# Altium project PowerBar.PrjPCB
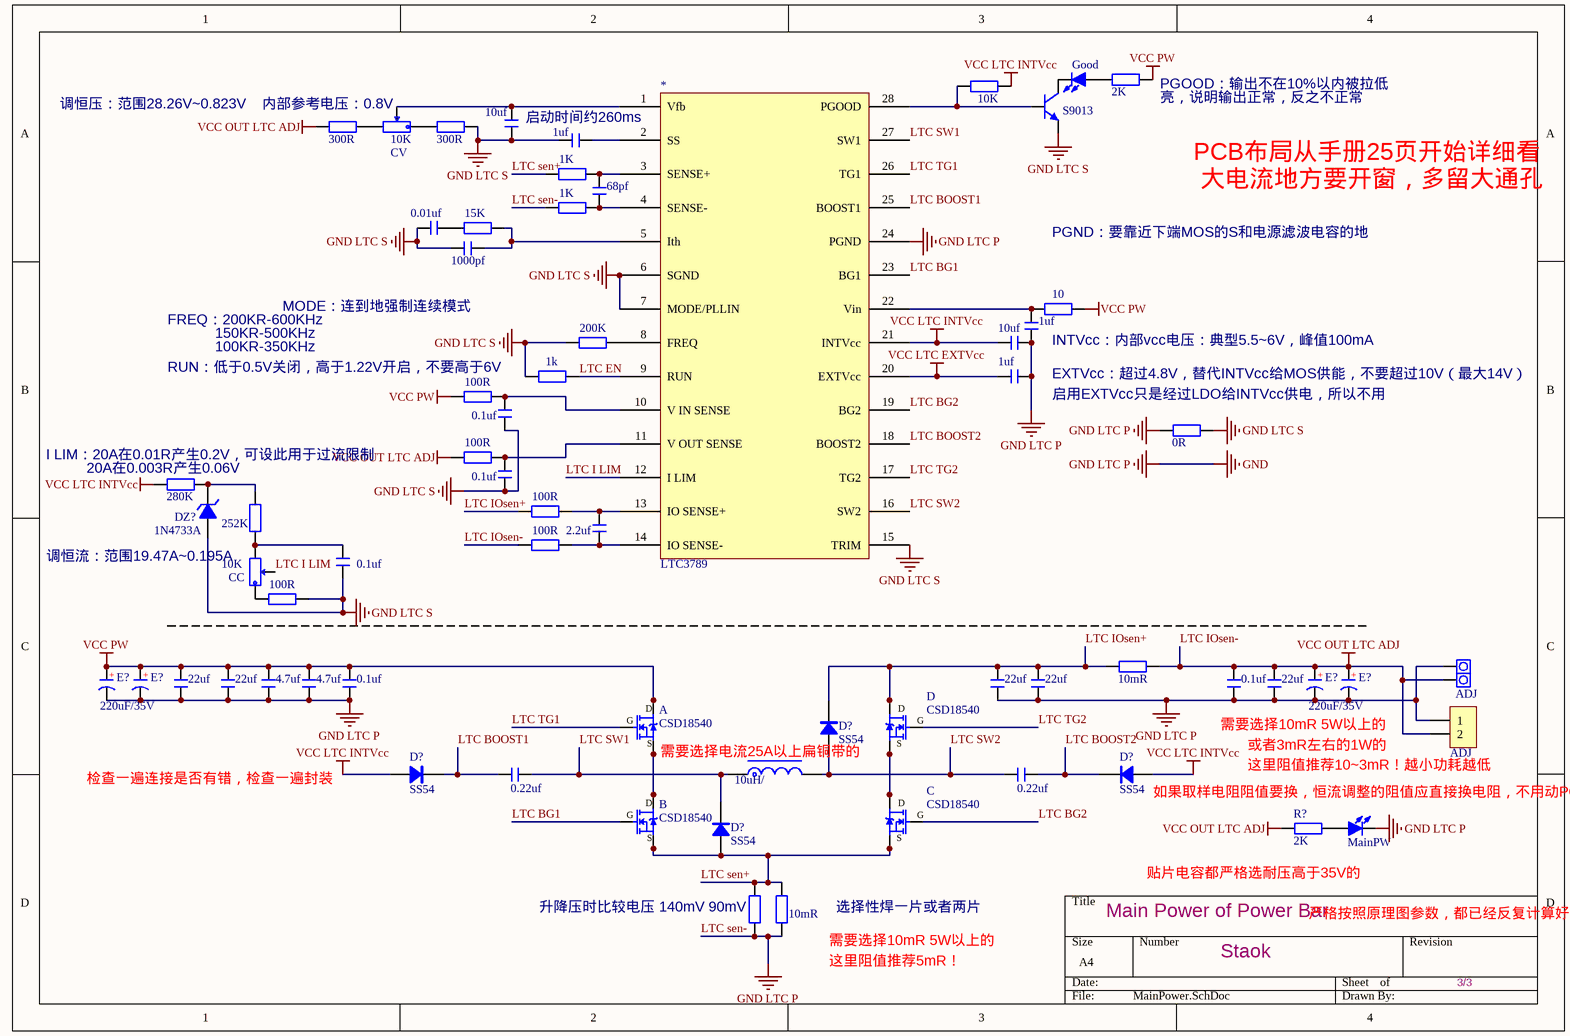
[diagram p0: MainPower.SchDoc]
3 sheets, 317 parts. Net scope: global (net labels, ports and power ports of the same name join across sheets).
Board file: PowerBar.PcbDoc
Sheets:
  MainPower.SchDoc
  SubPowerr.SchDoc
  modules.SchDoc

## Sheet MainPower.SchDoc: Main Power of Power Bar
size A4; Author: Staok

### Parts
(Parts that share a designator on the sheet are numbered #1, #2 ... from top to bottom, then left to right.)
*  LTC3789  [SSOP28_N]
A  CSD18540  [Q5B]
B  CSD18540  [Q5B]
C  CSD18540  [Q5B]
C?#1  10uf  [C 0805_L]
C?#2  1uf  [C 0805_L]
C?#3  68pf  [C 0805_L]
C?#4  0.01uf  [C 0805_L]
C?#5  1000pf  [C 0805_L]
C?#6  1uf  [C 0805_L]
C?#7  10uf  [C 0805_L]
C?#8  1uf  [C 0805_L]
C?#9  0.1uf  [C 0805_L]
C?#10  0.1uf  [C 0805_L]
C?#11  2.2uf  [C 0805_L]
C?#12  0.1uf  [C 0805_L]
C?#13  22uf  [C 0805_L]
C?#14  22uf  [C 0805_L]
C?#15  22uf  [C 0805_L]
C?#16  4.7uf  [C 0805_L]
C?#17  4.7uf  [C 0805_L]
C?#18  0.1uf  [C 0805_L]
C?#19  22uf  [C 0805_L]
C?#20  0.1uf  [C 0805_L]
C?#21  22uf  [C 0805_L]
C?#22  0.22uf  [C 0805_L]
C?#23  0.22uf  [C 0805_L]
CC  10K  [RV097-1-G15]
CV  10K  [RV097-1-G15]
D  CSD18540  [Q5B]
D?#1  SS54  [SMA]
D?#2  SS54  [SMA]
D?#3  SS54  [SMA]
D?#4  SS54  [SMA]
DZ?#1  1N4733A  [DO-41GV]
E?#1  220uF/35V  [CS 3.5*8*11.5 - R]
E?#2  220uF/35V  [CS 3.5*8*11.5 - R]  (value not drawn)
E?#3  220uF/35V  [CS 3.5*8*11.5 - R]
E?#4  220uF/35V  [CS 3.5*8*11.5 - R]  (value not drawn)
H?#1  ADJ  [T Head]
JP?#1  ADJ  [KF128-5.08-2P]
L?#1  10uH/  [L-SMD-0630]
LED?#1  Good  [LED 0805B]
LED?#2  MainPW  [LED 0805B]
Q?#1  S9013  [SOT23-3L]
R?#1  2K  [R 0805_L]
R?#2  10K  [R 0805_L]
R?#3  300R  [R 0805_L]
R?#4  300R  [R 0805_L]
R?#5  1K  [R 0805_L]
R?#6  1K  [R 0805_L]
R?#7  15K  [R 0805_L]
R?#8  10  [R 0805_L]
R?#9  200K  [R 0805_L]
R?#10  1k  [R 0805_L]
R?#11  100R  [R 0805_L]
R?#12  0R  [R 0805_L]
R?#13  100R  [R 0805_L]
R?#14  280K  [R 0805_L]
R?#15  252K  [R 0805_L]
R?#16  100R  [R 0805_L]
R?#17  100R  [R 0805_L]
R?#18  100R  [R 0805_L]
R?#19  10mR  [R 2512-HP_M]
R?#20  2K  [R 0805_L]
R?#21  10mR  [R 2512-HP_M]  (value not drawn)
R?#22  10mR  [R 2512-HP_M]

### Nets
GND LTC S: *.6(SGND) *.7(MODE/PLLIN) *.15(TRIM) C?#1.1 C?#2.2 C?#4.2 C?#5.2 C?#9.2 C?#10.2 C?#12.2 DZ?#1.1(A) Q?#1.2(E) R?#4.1 R?#9.1 R?#10.2 R?#12.2 R?#18.1
LTC IOsen-: C?#20.2 C?#21.2 E?#3.1(A) E?#4.1(A) H?#1.2 JP?#1.2 R?#3.1 R?#13.1 R?#17.1 R?#19.1 R?#20.2  [also labelled VCC OUT LTC ADJ]
LTC sen-: *.24(PGND) C?#6.2 C?#7.2 C?#8.2 C?#13.2 C?#14.2 C?#15.1 C?#16.1 C?#17.1 C?#18.1 C?#19.1 C?#20.1 C?#21.1 E?#1.2(K) E?#2.2(K) E?#3.2(K) E?#4.2(K) H?#1.1 JP?#1.1 LED?#2.2(K) R?#6.1 R?#12.1 R?#21.1 R?#22.1  [also labelled GND, GND LTC P]
VCC LTC EXTVcc: *.20(EXTVcc) C?#8.1
VCC LTC INTVcc: *.21(INTVcc) C?#7.1 D?#2.1(A) D?#3.1(A) R?#2.2 R?#14.2
VCC PW: A.5(D) A.6(D) A.7(D) A.8(D) C?#13.1 C?#15.2 C?#16.2 C?#17.2 C?#18.2 E?#1.1(A) E?#2.1(A) R?#1.1 R?#8.2 R?#11.1
LTC BG1: *.23(BG1) B.4(G)
LTC BG2: *.19(BG2) C.4(G)
LTC BOOST1: *.25(BOOST1) C?#22.2 D?#2.2(K)
LTC BOOST2: *.18(BOOST2) C?#23.1 D?#3.2(K)
LTC EN: *.9(RUN) R?#10.1
LTC I LIM: *.12(I_LIM) CC.2
LTC IOsen+: C?#14.1 C?#19.2 D.5(D) D.6(D) D.7(D) D.8(D) D?#1.2(K) R?#16.1 R?#19.2
LTC sen+: B.1(S) B.2(S) B.3(S) C.1(S) C.2(S) C.3(S) D?#4.1(A) R?#5.1 R?#21.2 R?#22.2
LTC SW1: *.27(SW1) C?#22.1 D?#4.2(K) L?#1.1
LTC SW2: *.16(SW2) C?#23.2 D?#1.1(A) L?#1.2
LTC TG1: *.26(TG1) A.4(G)
LTC TG2: *.17(TG2) D.4(G)
Net*_1: *.1(Vfb) C?#1.2 CV.2
Net*_2: *.2(SS) C?#2.1
Net*_3: *.3(SENSE+) C?#3.1 R?#5.2
Net*_4: *.4(SENSE-) C?#3.2 R?#6.2
Net*_5: *.5(Ith) C?#5.1 R?#7.2
Net*_8: *.8(FREQ) R?#9.2
Net*_10: *.10(V_IN_SENSE) C?#9.1 R?#11.2
Net*_11: *.11(V_OUT_SENSE) C?#10.1 R?#13.2
Net*_13: *.13(IO_SENSE+) C?#11.1 R?#16.2
Net*_14: *.14(IO_SENSE-) C?#11.2 R?#17.2
Net*_22: *.22(Vin) C?#6.1 R?#8.1
Net*_28: *.28(PGOOD) Q?#1.1(B) R?#2.1
NetA_1: A.1(S) A.2(S) A.3(S) B.5(D) B.6(D) B.7(D) B.8(D)
NetC?#4_1: C?#4.1 R?#7.1
NetC?#12_1: C?#12.1 CC.3 R?#15.2
NetC_5: C.5(D) C.6(D) C.7(D) C.8(D) D.1(S) D.2(S) D.3(S)
NetCC_1: CC.1 R?#18.2
NetCV_1: CV.1 R?#4.2
NetCV_3: CV.3 R?#3.2
NetDZ?#1_2: DZ?#1.2(K) R?#14.1 R?#15.1
NetLED?#1_1: LED?#1.1(A) R?#1.2
NetLED?#1_2: LED?#1.2(K) Q?#1.3(C)
NetLED?#2_1: LED?#2.1(A) R?#20.1

### Notes on the sheet
- 调恒压：范围28.26V~0.823V
- (near R?#3) 内部参考电压：0.8V
- (near R?#1) PGOOD：输出不在10%以内被拉低
- (near R?#1) 亮，说明输出正常，反之不正常
- (near C?#1) 启动时间约260ms
- PCB布局从手册25页开始详细看
- PGND：要靠近下端MOS的S和电源滤波电容的地
- 大电流地方要开窗，多留大通孔
- MODE：连到地强制连续模式
- RUN：低于0.5V关闭，高于1.22V开启，不要高于6V
- FREQ：200KR-600KHz
- 150KR-500KHz
- 100KR-350KHz
- INTVcc：内部vcc电压：典型5.5~6V，峰值100mA
- (near C?#8) EXTVcc：超过4.8V，替代INTVcc给MOS供能，不要超过10V（最大14V）
- 启用EXTVcc只是经过LDO给INTVcc供电，所以不用
- (near R?#14) I LIM：20A在0.01R产生0.2V，可设此用于过流限制
- (near R?#14) 20A在0.003R产生0.06V
- (near DZ?#1) 调恒流：范围19.47A~0.195A
- 检查一遍连接是否有错，检查一遍封装
- 需要选择电流25A以上扁铜带的
- (near C?#21) 需要选择10mR 5W以上的
- 或者3mR左右的1W的
- 这里阻值推荐10~3mR！越小功耗越低
- 如果取样电阻阻值要换，恒流调整的阻值应直接换电阻，不用动PCB
- 升降压时比较电压 140mV 90mV
- 选择性焊一片或者两片
- (near R?#20) 贴片电容都严格选耐压高于35V的
- 严格按照原理图参数，都已经反复计算好
- (near R?#22) 需要选择10mR 5W以上的
- 这里阻值推荐5mR！
- 3/3
- (in symbol C-CS) +

### Library data of the parts
C?#1-C?#23 = C: 无极性贴片电容; 版权归属: 源创客; 材质: X7R; BOM名称: 无极性贴片电容; 学习资源: www.ooocke.com
CC CV = RP-ID: 插件单联电位器; BOM名称: 插件电位器; 版权归属: 源创客; 学习资源: www.ooocke.com
D?#1-D?#4 = SS54: 肖特基二极管; 版权归属: 源创客; 属性: 40V/3A; BOM名称: 肖特基二极管; 学习资源: www.ooocke.com
DZ?#1 = 1N4620: 3.3V/0.5W稳压管; 版权归属: 源创客; BOM名称: 3.3V/0.5W稳压管; 学习资源: www.ooocke.com
E?#1-E?#4 = C-CS: 直插固态电容; 版权归属: 源创客; BOM名称: 直插固态电容; 学习资源: www.ooocke.com
H?#1 = PAD2: 引线焊盘; 版权归属: 源创客; BOM名称: 引线焊盘; 学习资源: www.ooocke.com
JP?#1 = Header 2: 2P接插件; 版权归属: 源创客; BOM名称: 2P接插件; 学习资源: www.ooocke.com
L?#1 = L-CD: 贴片功率电感; BOM名称: 功率电感; 版权归属: 源创客; 学习资源: www.ooocke.com
LED?#1 LED?#2 = LED-SMD: 贴片LED; 版权归属: 源创客; BOM名称: 贴片LED; 学习资源: www.ooocke.com
Q?#1 = 9013-SMD: 低频放大-NPN型; 版权归属: 源创客; 属性: 50V?0.5A?0.625W; BOM名称: 低频放大-NPN型; 学习资源: www.ooocke.com
R?#1-R?#18 R?#20 = R: 贴片电阻; 版权归属: 源创客; BOM名称: 贴片电阻; 学习资源: www.ooocke.com
R?#19 R?#21 R?#22 = R-Precision: 精密贴片电阻; BOM名称: 精密电阻; 版权归属: 源创客; 学习资源: www.ooocke.com

## Sheet SubPowerr.SchDoc: Sub Power of Power Bar
size 381 x 193 mm; Author: Staok; DrawnBy: Staok; Revision: 3.14
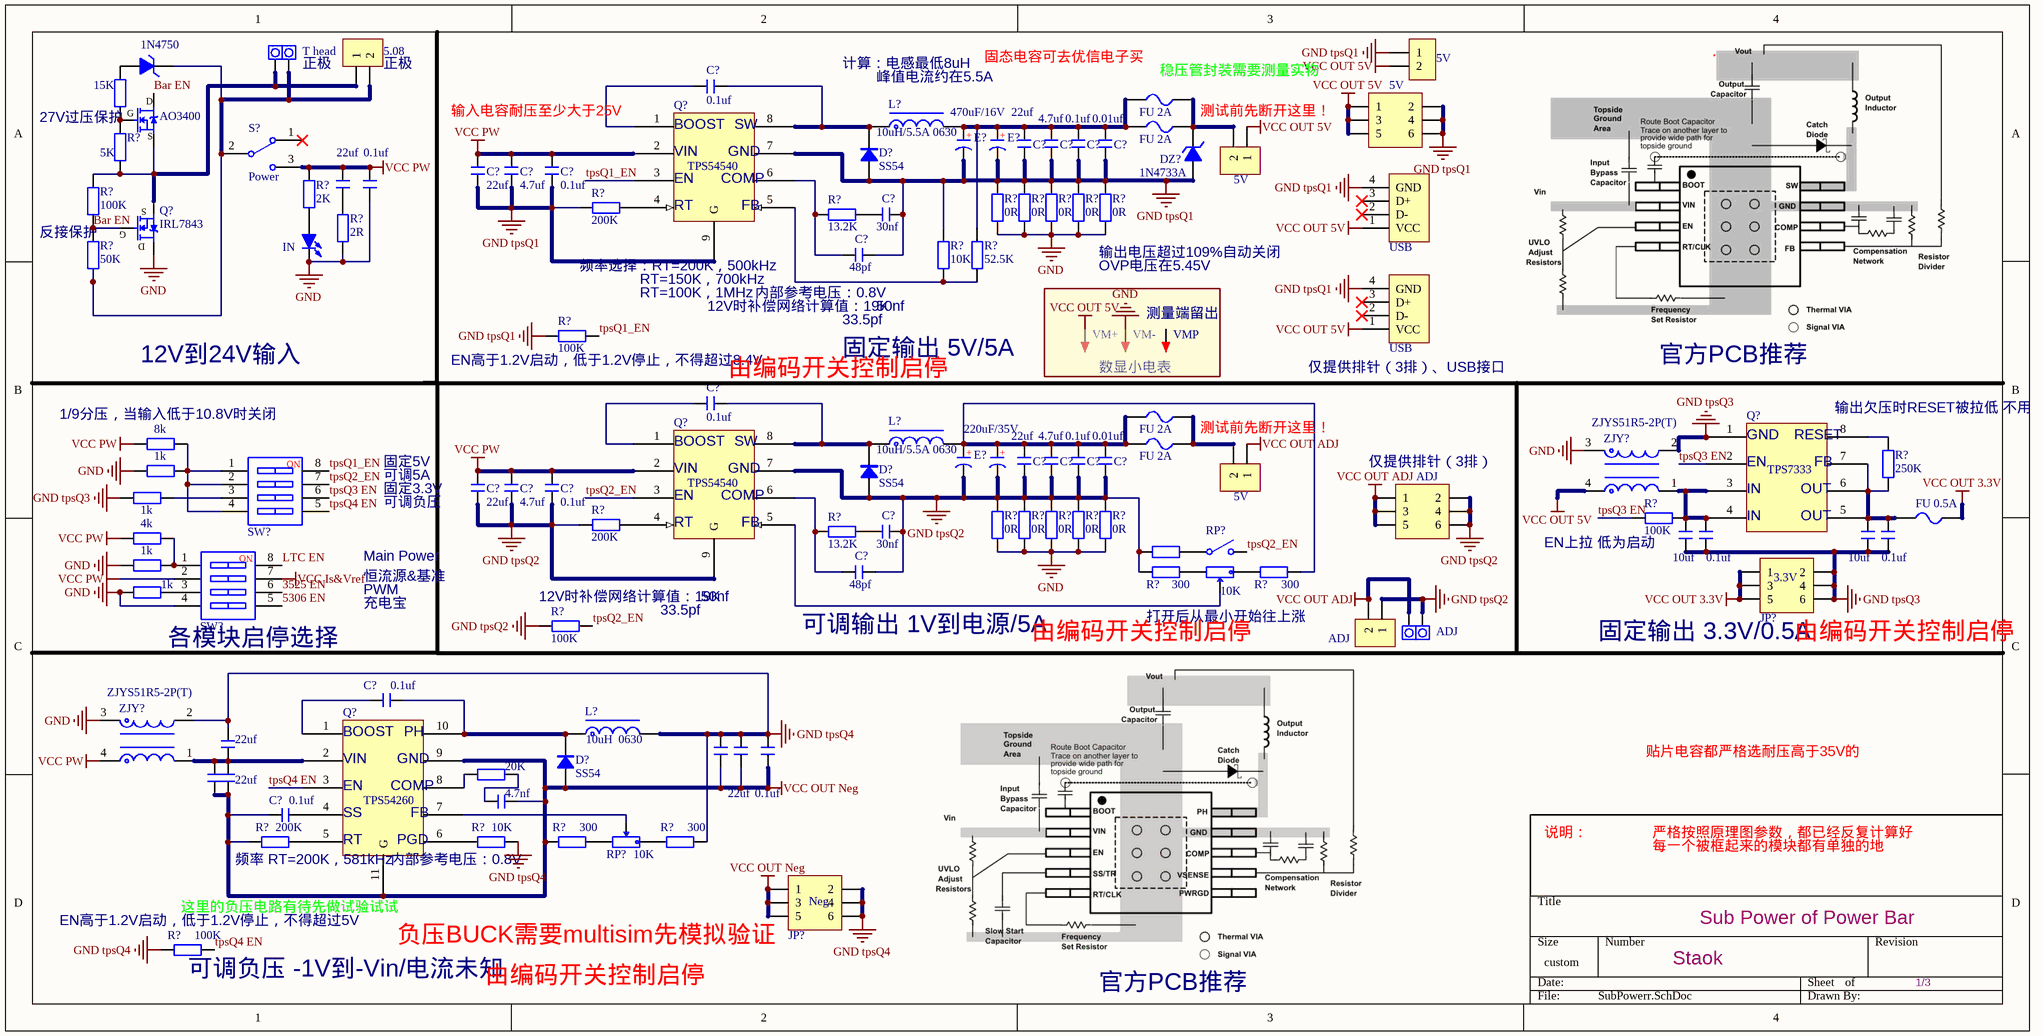
[diagram p1: SubPowerr.SchDoc]

### Parts
(Parts that share a designator on the sheet are numbered #1, #2 ... from top to bottom, then left to right.)
C?#24  0.1uf  [C 0805_L]
C?#25  22uf  [C 0805_L]
C?#26  4.7uf  [C 0805_L]
C?#27  0.1uf  [C 0805_L]
C?#28  0.01uf  [C 0805_L]
C?#29  22uf  [C 0805_L]
C?#30  4.7uf  [C 0805_L]
C?#31  0.1uf  [C 0805_L]
C?#32  22uf  [C 0805_L]
C?#33  0.1uf  [C 0805_L]
C?#34  30nf  [C 0805_L]
C?#35  48pf  [C 0805_L]
C?#36  0.1uf  [C 0805_L]
C?#37  22uf  [C 0805_L]
C?#38  4.7uf  [C 0805_L]
C?#39  0.1uf  [C 0805_L]
C?#40  0.01uf  [C 0805_L]
C?#41  22uf  [C 0805_L]
C?#42  4.7uf  [C 0805_L]
C?#43  0.1uf  [C 0805_L]
C?#44  30nf  [C 0805_L]
C?#45  10uf  [C 0805_L]
C?#46  0.1uf  [C 0805_L]
C?#47  10uf  [C 0805_L]
C?#48  0.1uf  [C 0805_L]
C?#49  48pf  [C 0805_L]
C?#50  0.1uf  [C 0805_L]
C?#51  22uf  [C 0805_L]
C?#52  22uf  [C 0805_L]  (value not drawn)
C?#53  22uf  [C 0805_L]
C?#54  0.1uf  [C 0805_L]
C?#55  22uf  [C 0805_L]  (value not drawn)
C?#56  22uf  [C 0805_L]
C?#57  4.7nf  [C 0805_L]
C?#58  0.1uf  [C 0805_L]
D?#5  SS54  [SMA]
D?#6  SS54  [SMA]
D?#7  SS54  [SMA]
DZ?#2  1N4750  [DO-41GV]
DZ?#3  1N4733A  [DO-41GV]
E?#5  470uF/16V  [CS 2.5*6.3*11 - R]
E?#6  470uF/16V  [CS 2.5*6.3*11 - R]  (value not drawn)
E?#7  220uF/35V  [CS 3.5*8*11.5 - R]
E?#8  220uF/35V  [CS 3.5*8*11.5 - R]  (value not drawn)
F?#1  FU 2A  [FU 1812]
F?#2  FU 2A  [FU 1812]
F?#3  FU 2A  [FU 1812]
F?#4  FU 2A  [FU 1812]
F?#5  FU 0.5A  [FU 0805]
H?#2  T head  [T Head]
H?#3  ADJ  [T Head]
JP?#2  5V  [KF128-5.08-2P]
JP?#3  5.08  [KF128-5.08-2P]
JP?#4  5V  [HDR2.54-LI-2x3P]
JP?#5  5V  [HDR2.54-LI-2P]
JP?#6  5V  [HDR2.54-LI-2P]
JP?#7  ADJ  [HDR2.54-LI-2x3P]
JP?#8  3.3V  [HDR2.54-LI-2x3P]
JP?#9  ADJ  [KF128-5.08-2P]
JP?#10  Neg  [HDR2.54-LI-2x3P]
L?#2  10uH/5.5A 0630  [L-SMD-0630]
L?#3  10uH/5.5A 0630  [L-SMD-0630]
L?#4  10uH  0630  [L-SMD-0630]
LED?#3  IN  [LED 0805B]
Q?#2  AO3400  [SOT23-3N]
Q?#3  TPS54540  [ESOP8_M]
Q?#4  IRL7843  [TO252]
Q?#5  TPS7333  [SOP8_N]
Q?#6  TPS54540  [ESOP8_M]
Q?#7  TPS54260  [ESOP10]
R?#23  15K  [R 0805_L]
R?#24  5K  [R 0805_L]
R?#25  200K  [R 0805_L]
R?#26  13.2K  [R 0805_L]
R?#27  2K  [R 0805_L]
R?#28  100K  [R 0805_L]
R?#29  10K  [R 0805_L]
R?#30  52.5K  [R 0805_L]
R?#31  0R  [R 0805_L]
R?#32  0R  [R 0805_L]
R?#33  0R  [R 0805_L]
R?#34  0R  [R 0805_L]
R?#35  0R  [R 0805_L]
R?#36  2R  [R 0805_L]
R?#37  50K  [R 0805_L]
R?#38  100K  [R 0805_L]
R?#39  8k  [R 0805_L]
R?#40  1k  [R 0805_L]
R?#41  250K  [R 0805_L]
R?#42  1k  [R 0805_L]
R?#43  100K  [R 0805_L]
R?#44  200K  [R 0805_L]
R?#45  13.2K  [R 0805_L]
R?#46  4k  [R 0805_L]
R?#47  0R  [R 0805_L]
R?#48  0R  [R 0805_L]
R?#49  0R  [R 0805_L]
R?#50  0R  [R 0805_L]
R?#51  0R  [R 0805_L]
R?#52  100  [R 0805_L]  (value not drawn)
R?#53  1k  [R 0805_L]
R?#54  300  [R 0805_L]
R?#55  300  [R 0805_L]
R?#56  1k  [R 0805_L]
R?#57  100K  [R 0805_L]
R?#58  20K  [R 0805_L]
R?#59  200K  [R 0805_L]
R?#60  10K  [R 0805_L]
R?#61  300  [R 0805_L]
R?#62  300  [R 0805_L]
R?#63  100K  [R 0805_L]
RP?#1  10K  [RV097-K-1-G15]
RP?#2  10K  [RV097-1-G15]
S?#1  Power  [MTS-10x]
SW?#1  CSW-4P  [CSW2.54 SMD-4P]  (value not drawn)
SW?#2  CSW-4P  [CSW2.54 SMD-4P]  (value not drawn)
TP?#1  VM+  [TEST 2.0]
TP?#2  VM-  [TEST 2.0]
TP?#3  VMP  [TEST 2.0]
USB?#1  USB  [USB-A/S_A]
USB?#2  USB  [USB-A/S_A]
ZJY?#1  ZJYS51R5-2P(T)  [ZJYS51R5-2P(T)]
ZJY?#2  ZJYS51R5-2P(T)  [ZJYS51R5-2P(T)]

### Nets
GND: C?#33.1 LED?#3.2(K) Q?#4.2(S) R?#31.1 R?#32.1 R?#33.1 R?#34.1 R?#35.1 R?#36.1 R?#40.1 R?#47.1 R?#48.1 R?#49.1 R?#50.1 R?#51.1 R?#53.2 R?#56.2 SW?#2.4 TP?#2.1 ZJY?#1.3 ZJY?#2.3  [project net LTC sen-]
GND tpsQ1: C?#25.1 C?#26.1 C?#27.1 C?#28.1 C?#29.1 C?#30.1 C?#31.1 C?#34.1 C?#35.1 D?#5.1(A) DZ?#3.1(A) E?#5.2(K) E?#6.2(K) JP?#2.1 JP?#4.2 JP?#4.4 JP?#4.6 Q?#3.7 Q?#3.9(G) R?#25.2 R?#29.1 R?#31.2 R?#32.2 R?#33.2 R?#34.2 R?#35.2 R?#38.1 USB?#1.4(GND) USB?#2.4(GND)
GND tpsQ2: C?#37.1 C?#38.1 C?#39.1 C?#40.1 C?#41.1 C?#42.1 C?#43.1 C?#44.1 C?#49.1 D?#6.1(A) E?#7.2(K) E?#8.2(K) H?#3.1 JP?#7.2 JP?#7.4 JP?#7.6 JP?#9.1 Q?#6.7 Q?#6.9(G) R?#44.2 R?#47.2 R?#48.2 R?#49.2 R?#50.2 R?#51.2 R?#52.2 R?#54.2 R?#57.1
GND tpsQ3: C?#45.1 C?#46.1 C?#47.1 C?#48.1 JP?#8.2 JP?#8.4 JP?#8.6 Q?#5.1 R?#42.2 ZJY?#1.2
GND tpsQ4: C?#51.1 C?#52.2 C?#53.2 C?#54.2 JP?#10.2 JP?#10.4 JP?#10.6 L?#4.2 R?#60.1 R?#62.1 R?#63.1 ZJY?#2.2
VCC Is&Vref: SW?#2.7
VCC OUT 3.3V: F?#5.2 JP?#8.1 JP?#8.3 JP?#8.5
VCC OUT 5V: JP?#2.2 JP?#4.1 JP?#4.3 JP?#4.5 JP?#5.1 TP?#1.1 USB?#1.1(VCC) USB?#2.1(VCC) ZJY?#1.4
VCC OUT ADJ: H?#3.2 JP?#6.1 JP?#7.1 JP?#7.3 JP?#7.5 JP?#9.2
VCC OUT Neg: C?#52.1 C?#53.1 C?#54.1 C?#55.1 C?#56.1 C?#57.1 C?#58.2 D?#7.1(A) JP?#10.1 JP?#10.3 JP?#10.5 Q?#7.9 Q?#7.11(G) R?#59.2 R?#61.2
VCC PW: C?#29.2 C?#30.2 C?#31.2 C?#32.2 C?#33.2 C?#41.2 C?#42.2 C?#43.2 Q?#3.2 Q?#6.2 R?#27.2 R?#39.1 R?#46.2 S?#1.3 SW?#2.2 ZJY?#2.4
3525 EN: SW?#2.6
5306 EN: SW?#2.5
Bar EN: Q?#2.3(D) Q?#4.1(G) R?#28.1 R?#37.2
LTC EN: SW?#2.8
tpsQ1_EN: Q?#3.3 R?#38.2 SW?#1.8
tpsQ2_EN: Q?#6.3 R?#57.2 RP?#1.4 SW?#1.7
tpsQ3 EN: Q?#5.2 R?#43.2 SW?#1.6
tpsQ4 EN: Q?#7.3 R?#63.2 SW?#1.5
NetC?#24_1: C?#24.1 D?#5.2(K) L?#2.1 Q?#3.8
NetC?#24_2: C?#24.2 Q?#3.1
NetC?#25_2: C?#25.2 C?#26.2 C?#27.2 C?#28.2 E?#5.1(A) E?#6.1(A) F?#1.1 F?#2.1 L?#2.2 R?#30.1
NetC?#32_1: C?#32.1 R?#36.2
NetC?#34_2: C?#34.2 R?#26.1
NetC?#35_2: C?#35.2 Q?#3.6 R?#26.2
NetC?#36_1: C?#36.1 D?#6.2(K) L?#3.1 Q?#6.8
NetC?#36_2: C?#36.2 Q?#6.1
NetC?#37_2: C?#37.2 C?#38.2 C?#39.2 C?#40.2 E?#7.1(A) E?#8.1(A) F?#3.1 F?#4.1 L?#3.2 R?#55.2
NetC?#44_2: C?#44.2 R?#45.1
NetC?#45_2: C?#45.2 C?#46.2 Q?#5.3 Q?#5.4 R?#43.1 ZJY?#1.1
NetC?#47_2: C?#47.2 C?#48.2 F?#5.1 Q?#5.5 Q?#5.6 Q?#5.7 R?#41.1
NetC?#49_2: C?#49.2 Q?#6.6 R?#45.2
NetC?#50_1: C?#50.1 Q?#7.1
NetC?#50_2: C?#50.2 D?#7.2(K) L?#4.1 Q?#7.10
NetC?#51_2: C?#51.2 C?#55.2 C?#56.2 Q?#7.2 ZJY?#2.1
NetC?#57_2: C?#57.2 R?#58.2
NetC?#58_1: C?#58.1 Q?#7.4
NetDZ?#2_1: DZ?#2.1(A) R?#23.2
NetDZ?#2_2: DZ?#2.2(K) H?#2.2 JP?#3.2 R?#37.1 S?#1.2
NetDZ?#3_2: DZ?#3.2(K) F?#1.2 F?#2.2 JP?#5.2
NetF?#3_2: F?#3.2 F?#4.2 JP?#6.2
NetH?#2_1: H?#2.1 JP?#3.1 Q?#2.2(S) Q?#4.3(D) R?#24.1 R?#28.2
NetLED?#3_1: LED?#3.1(A) R?#27.1
NetQ?#2_1: Q?#2.1(G) R?#23.1 R?#24.2
NetQ?#3_4: Q?#3.4 R?#25.1
NetQ?#3_5: Q?#3.5 R?#29.2 R?#30.2
NetQ?#5_8: Q?#5.8 R?#41.2
NetQ?#6_4: Q?#6.4 R?#44.1
NetQ?#6_5: Q?#6.5 RP?#1.2
NetQ?#7_5: Q?#7.5 R?#59.1
NetQ?#7_6: Q?#7.6 R?#60.2
NetQ?#7_7: Q?#7.7 RP?#2.2
NetQ?#7_8: Q?#7.8 R?#58.1
NetR?#39_2: R?#39.2 R?#40.2 SW?#1.1 SW?#1.2 SW?#1.4
NetR?#42_1: R?#42.1 SW?#1.3
NetR?#46_1: R?#46.1 R?#53.1 SW?#2.1
NetR?#52_1: R?#52.1 RP?#1.5
NetR?#54_1: R?#54.1 RP?#1.3
NetR?#55_1: R?#55.1 RP?#1.1
NetR?#56_1: R?#56.1 SW?#2.3
NetR?#61_1: R?#61.1 RP?#2.3
NetR?#62_2: R?#62.2 RP?#2.1

Not connected (* = marked no-connect by the designer): S?#1 1*; TP?#3 1; USB?#1 2(D-)* 3(D+)*; USB?#2 2(D-)* 3(D+)*

### Notes on the sheet
- (near H?#2) 正极
- (near JP?#3) 正极
- (near C?#29) 输入电容耐压至少大于25V
- 计算：电感最低8uH
- 峰值电流约在5.5A
- 固态电容可去优信电子买
- (near F?#1) 稳压管封装需要测量实物
- 测试前先断开这里！
- (near R?#23) 27V过压保护
- (near Q?#3) BOOST
- (near Q?#3) VIN
- (near Q?#3) GND
- (near Q?#3) SW
- (near R?#37) 反接保护
- (near Q?#3) EN
- (near Q?#3) RT
- (near Q?#3) COMP
- (near Q?#3) FB
- 频率选择：RT=200K，500kHz
- RT=150K，700kHz
- RT=100K，1MHz
- 12V时补偿网络计算值：19K
- (near C?#35) 内部参考电压：0.8V
- 50nf
- (near R?#35) 输出电压超过109%自动关闭
- (near R?#35) OVP电压在5.45V
- 12V到24V输入
- (near R?#38) EN高于1.2V启动，低于1.2V停止，不得超过8.4V
- (near C?#36) 由编码开关控制启停
- 33.5pf
- 固定输出 5V/5A
- (near TP?#2) 数显小电表
- (near TP?#3) 测量端留出
- (near USB?#2) 仅提供排针（3排）、USB接口
- 官方PCB推荐
- (near R?#39) 1/9分压，当输入低于10.8V时关闭
- (near Q?#6) BOOST
- (near Q?#6) SW
- (near Q?#5) GND
- (near Q?#5) RESET
- 输出欠压时RESET被拉低 不用
- 固定5V
- (near C?#41) 固定3.3V
- 可调负压
- 可调5A
- (near Q?#6) VIN
- (near Q?#6) EN
- (near Q?#6) COMP
- (near Q?#6) GND
- (near JP?#7) 仅提供排针（3排）
- (near Q?#5) EN
- (near Q?#5) IN
- (near Q?#5) OUT
- (near Q?#5) FB
- 恒流源&基准
- Main Power
- (near Q?#6) RT
- (near Q?#6) FB
- EN上拉 低为启动
- 各模块启停选择
- 充电宝
- PWM
- (near R?#57) 12V时补偿网络计算值：19K
- (near Q?#6) 50nf
- (near C?#49) 可调输出 1V到电源/5A
- (near R?#54) 由编码开关控制启停
- 打开后从最小开始往上涨
- (near JP?#8) 固定输出 3.3V/0.5A
- (near JP?#8) 由编码开关控制启停
- (near Q?#7) BOOST
- (near Q?#7) VIN
- (near Q?#7) EN
- (near Q?#7) COMP
- (near Q?#7) GND
- (near Q?#7) PH
- 贴片电容都严格选耐压高于35V的
- (near Q?#7) SS
- (near Q?#7) RT
- (near Q?#7) PGD
- (near Q?#7) FB
- 说明：
- 严格按照原理图参数，都已经反复计算好
- 每一个被框起来的模块都有单独的地
- (near R?#63) EN高于1.2V启动，低于1.2V停止，不得超过5V
- (near R?#63) 这里的负压电路有待先做试验试试
- (near Q?#7) 频率 RT=200K，581kHz
- (near Q?#7) 内部参考电压：0.8V
- (near R?#63) 可调负压 -1V到-Vin/电流未知
- 负压BUCK需要multisim先模拟验证
- 由编码开关控制启停
- 1/3
- (in symbol C-CS) +
- (in symbol CSW-4P) NO

### Library data of the parts
C?#24-C?#58 = C: 无极性贴片电容; 版权归属: 源创客; 材质: X7R; BOM名称: 无极性贴片电容; 学习资源: www.ooocke.com
D?#5-D?#7 = SS54: 肖特基二极管; 版权归属: 源创客; 属性: 40V/3A; BOM名称: 肖特基二极管; 学习资源: www.ooocke.com
DZ?#2 DZ?#3 = 1N4620: 3.3V/0.5W稳压管; 版权归属: 源创客; BOM名称: 3.3V/0.5W稳压管; 学习资源: www.ooocke.com
E?#5-E?#8 = C-CS: 直插固态电容; 版权归属: 源创客; BOM名称: 直插固态电容; 学习资源: www.ooocke.com
F?#1-F?#5 = FU: 贴片保险丝; 版权归属: 源创客; BOM名称: 贴片保险丝; 学习资源: www.ooocke.com
H?#2 H?#3 = PAD2: 引线焊盘; 版权归属: 源创客; BOM名称: 引线焊盘; 学习资源: www.ooocke.com
JP?#2 JP?#3 JP?#5 JP?#6 JP?#9 = Header 2: 2P接插件; 版权归属: 源创客; BOM名称: 2P接插件; 学习资源: www.ooocke.com
JP?#4 JP?#7 JP?#8 JP?#10 = Header 3X2: 3*2P接插件; 版权归属: 源创客; BOM名称: 3*2P接插件; 学习资源: www.ooocke.com
L?#2-L?#4 = L-CD: 贴片功率电感; BOM名称: 功率电感; 版权归属: 源创客; 学习资源: www.ooocke.com
LED?#3 = LED-SMD: 贴片LED; 版权归属: 源创客; BOM名称: 贴片LED; 学习资源: www.ooocke.com
Q?#2 = AO3400: N沟道 30V/4.2A; BOM名称: 场效应管; 版权归属: 源创客; 学习资源: www.ooocke.com; 描述: N沟道 30V/4.2A
Q?#3 Q?#6 = ESOP8
Q?#4 = IRF3710: N沟道 100V/57A; BOM名称: 场效应管; 版权归属: 源创客; 学习资源: www.ooocke.com; 描述: N沟道 100V/57A
Q?#5 = 8
Q?#7 = ESOP10
R?#23-R?#63 = R: 贴片电阻; 版权归属: 源创客; BOM名称: 贴片电阻; 学习资源: www.ooocke.com
RP?#1 = RP-KEY-ID: 插件单联开关型电位器; BOM名称: 开关型电位器; 版权归属: 源创客; 学习资源: www.ooocke.com
RP?#2 = RP-ID: 插件单联电位器; BOM名称: 插件电位器; 版权归属: 源创客; 学习资源: www.ooocke.com
S?#1 = MTS-10x: MTS10x系列3脚扭子开关; 版权归属: 源创客; BOM名称: MTS10x系列3脚扭子开关; 学习资源: www.ooocke.com
SW?#1 SW?#2 = CSW-4P: 4路编码开关; 版权归属: 源创客; BOM名称: 4路编码开关; 学习资源: www.ooocke.com
TP?#1-TP?#3 = TEST: 测试点; 版权归属: 源创客; BOM名称: 测试点; 学习资源: www.ooocke.com
USB?#1 USB?#2 = USB-A/S: USB-A型母接口; 版权归属: 源创客; BOM名称: USB-A型母接口; 学习资源: www.ooocke.com

## Sheet modules.SchDoc: Modules of Power Bar
size 457 x 193 mm; Author: Staok
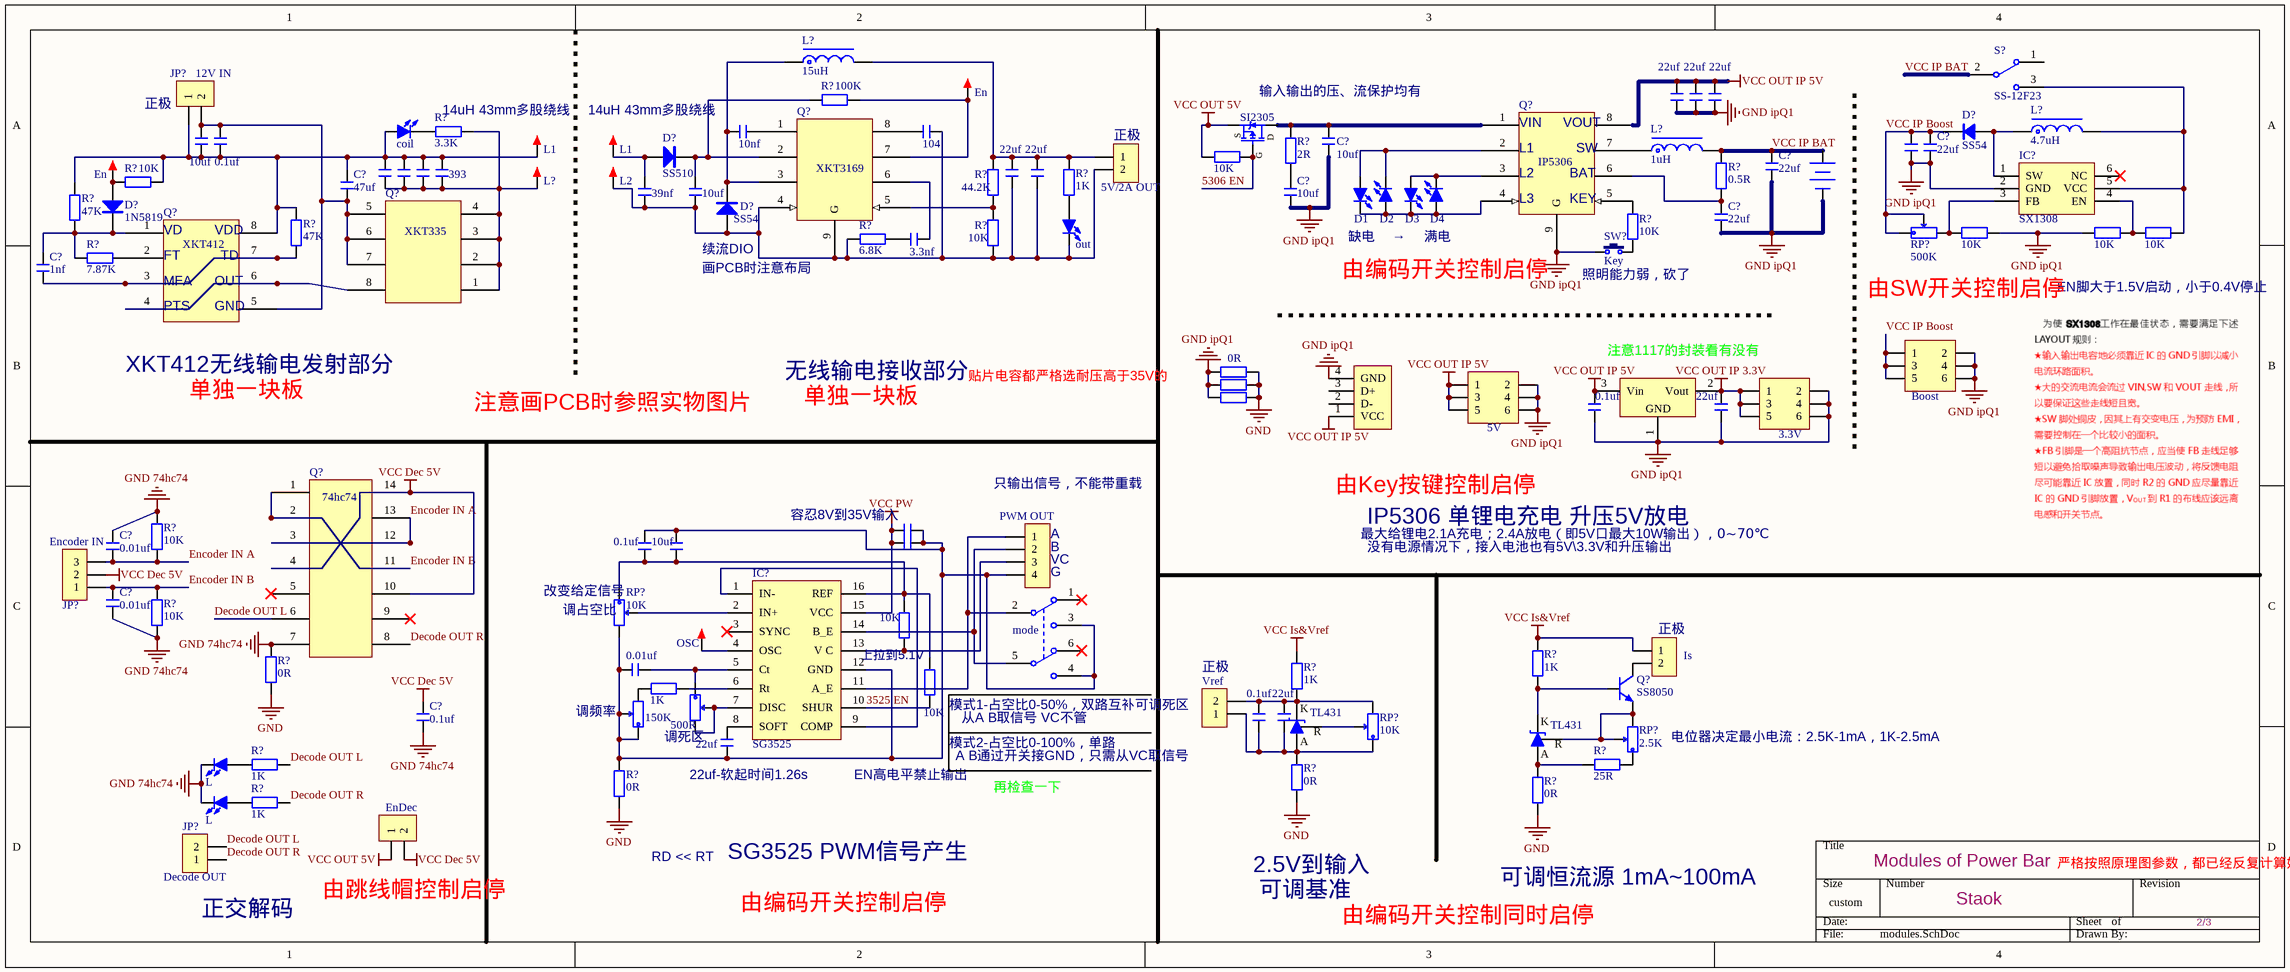
[diagram p2: modules.SchDoc]

### Parts
(Parts that share a designator on the sheet are numbered #1, #2 ... from top to bottom, then left to right.)
BT?  BATTERY  [KF128-5.08-2P]  (value not drawn)
C?#59  22uf  [C 0805_L]
C?#60  22uf  [C 0805_L]
C?#61  22uf  [C 0805_L]
C?#62  10nf  [C 0805_L]
C?#63  104  [C 0805_L]
C?#64  10uf  [C 1206_M]
C?#65  0.1uf  [C 1206_M]
C?#66  10uf  [C 0805_L]
C?#67  22uf  [C 0805_L]  (value not drawn)
C?#68  22uf  [C 0805_L]
C?#69  22uf  [C 0805_L]
C?#70  393  [C 0805_L]  (value not drawn)
C?#71  393  [C 0805_L]  (value not drawn)
C?#72  393  [C 0805_L]  (value not drawn)
C?#73  393  [C 0805_L]
C?#74  22uf  [C 0805_L]
C?#75  22uf  [C 0805_L]
C?#76  47uf  [C 1206_M]
C?#77  39nf  [C 1206_M]
C?#78  10uf  [C 0805_L]
C?#79  10uf  [C 0805_L]
C?#80  22uf  [C 0805_L]
C?#81  3.3nf  [C 0805_L]
C?#82  1nf  [C 0805_L]
C?#83  0.1uf  [C 0805_L]
C?#84  22uf  [C 0805_L]
C?#85  22uf  [C 0805_L]  (value not drawn)
C?#86  0.1uf  [C 0805_L]  (value not drawn)
C?#87  0.01uf  [C 0805_L]
C?#88  0.1uf  [C 0805_L]
C?#89  10uf  [C 0805_L]
C?#90  0.01uf  [C 0805_L]
C?#91  0.1uf  [C 0805_L]
C?#92  0.1uf  [C 0805_L]
C?#93  22uf  [C 0805_L]
C?#94  22uf  [C 0805_L]
CT?  0.01uf  [C 0805_L]
D?#8  SS54  [SMA]
D?#9  SS510  [SMC]
D?#10  1N5819  [SOD-323]
D?#11  SS54  [SMA]
IC?#1  SX1308  [SOT23-6N]
IC?#2  SG3525  [SOP16_N]
IC?#3  TL431  [SOT23-3N]
IC?#4  TL431  [SOT23-3N]
JP?#11  12V IN  [HDR2.54-LI-2P]
JP?#12  5V/2A OUT  [HDR2.54-LI-2P]
JP?#13  Boost  [HDR2.54-LI-2x3P]
JP?#14  5V  [HDR2.54-LI-2x3P]
JP?#15  3.3V  [HDR2.54-LI-2x3P]
JP?#16  PWM OUT  [HDR2.54-LI-4P]
JP?#17  Encoder IN  [HDR2.54-M-LI-3P]
JP?#18  Is  [HDR2.54-LI-2P]
JP?#19  Vref  [HDR2.54-LI-2P]
JP?#20  Decode OUT  [HDR2.54-LI-2P]
JP?#21  EnDec  [HDR2.54-LI-2P]
L?#5  15uH  [L-SMD-0630]
L?#6  4.7uH  [L-SMD-0630]
L?#7  1uH  [L-SMD-0630]
LED?#4  coil  [LED 0805B]
LED?#5  D1  [LED 0805B]
LED?#6  D3  [LED 0805B]
LED?#7  out  [LED 0805B]
LED?#8  D2  [LED 0805B]
LED?#9  D4  [LED 0805B]
LED?#10  L  [LED 0805B]
LED?#11  L  [LED 0805B]
Q?#8  SI2305  [SOT23-3N]
Q?#9  IP5306  [ESOP8_M]
Q?#10  XKT3169  [ESOP8_M]
Q?#11  XKT412  [SOP8_M]
Q?#12  XKT335  [SOP8_M]
Q?#13  74hc74  [SOP14_N]
Q?#14  SS8050  [SOT23-3N]
R?#64  100K  [R 0805_L]
R?#65  2R  [R 0805_L]
R?#66  3.3K  [R 0805_L]
R?#67  0.5R  [R 0805_L]
R?#68  44.2K  [R 0805_L]
R?#69  10K  [R 0805_L]
R?#70  47K  [R 0805_L]
R?#71  10K  [R 0805_L]
R?#72  10K  [R 0805_L]
R?#73  1K  [R 0805_L]
R?#74  10K  [R 0805_L]
R?#75  10K  [R 0805_L]
R?#76  10K  [R 0805_L]
R?#77  6.8K  [R 0805_L]
R?#78  10K  [R 0805_L]
R?#79  7.87K  [R 0805_L]
R?#80  47K  [R 0805_L]
R?#81  0R  [R 0805_L]
R?#82  0R  [R 0805_L]  (value not drawn)
R?#83  0R  [R 0805_L]  (value not drawn)
R?#84  10K  [R 0805_L]
R?#85  10K  [R 0805_L]
R?#86  10K  [R 0805_L]
R?#87  1K  [R 0805_L]
R?#88  1K  [R 0805_L]
R?#89  1K  [R 0805_L]
R?#90  0R  [R 0805_L]
R?#91  10K  [R 0805_L]
R?#92  0R  [R 0805_L]
R?#93  0R  [R 0805_L]
R?#94  1K  [R 0805_L]
R?#95  0R  [R 0805_L]
R?#96  25R  [R 0805_L]
R?#97  1K  [R 0805_L]
RD?  500R  [3362P]
RP?#3  500K  [3296W]
RP?#4  10K  [3362P]
RP?#5  10K  [3296W]
RP?#6  2.5K  [3296W]
RT?  150K  [3362P]
S?#2  SS-12F23  [SS-12D10]
S?#3  mode  [SS-22H07-G5]
SW?#3  Key  [TSW SMD-3*6*2.5]
TP?#4  En  [TEST 1]
TP?#5  L1  [TEST 2.0]
TP?#6  L1  [TEST 2.0]
TP?#7  En  [TEST 1]
TP?#8  L?  [TEST 2.0]
TP?#9  L2  [TEST 2.0]
TP?#10  OSC  [TEST 1]
USB?#3  USB  [USB-A/S_A]  (value not drawn)
V?  AMS1117-3V3  [SOT89_M]  (value not drawn)

### Nets
GND: R?#81.2 R?#82.2 R?#83.2 R?#90.1 R?#92.2 R?#93.2 R?#95.2  [project net LTC sen-]
GND 74hc74: C?#87.2 C?#90.1 C?#91.1 LED?#10.2(K) LED?#11.2(K) Q?#13.7 R?#84.2 R?#86.1 R?#90.2
GND ipQ1: BT?.2(-) C?#59.1 C?#60.1 C?#61.1 C?#66.1 C?#67.1 C?#68.1 C?#69.1 C?#79.1 C?#80.1 C?#83.1 C?#84.1 IC?#1.2(GND) JP?#13.2 JP?#13.4 JP?#13.6 JP?#14.2 JP?#14.4 JP?#14.6 JP?#15.2 JP?#15.4 JP?#15.6 Q?#9.9(G) R?#74.1 R?#75.1 R?#81.1 R?#82.1 R?#83.1 SW?#3.1 USB?#3.4(GND) V?.1(GND)
VCC Dec 5V: C?#91.2 JP?#17.2 JP?#21.2 Q?#13.4 Q?#13.10 Q?#13.14
VCC Is&Vref: JP?#18.1 R?#87.1 R?#88.1
VCC OUT 5V: JP?#21.1 Q?#8.2(S) R?#69.2
VCC OUT IP 3.3V: C?#84.2 JP?#15.1 JP?#15.3 JP?#15.5 V?.2(Vout)
VCC OUT IP 5V: C?#59.2 C?#60.2 C?#61.2 C?#83.2 JP?#14.1 JP?#14.3 JP?#14.5 Q?#9.8 USB?#3.1(VCC) V?.3(Vin)
VCC PW: C?#85.2 C?#86.2 IC?#2.15(VCC)
3525 EN: IC?#2.10(SHUR) R?#91.1
5306 EN: Q?#8.1(G) R?#69.1
Decode OUT L: JP?#20.2 Q?#13.6 R?#94.1
Decode OUT R: JP?#20.1 Q?#13.8 R?#97.1
Encoder IN A: C?#87.1 JP?#17.3 Q?#13.3 Q?#13.12 Q?#13.13 R?#84.1
Encoder IN B: C?#90.2 JP?#17.1 Q?#13.1 Q?#13.2 Q?#13.11 R?#86.2
VCC IP BAT: BT?.1(+) C?#69.2 L?#7.2 R?#67.1 S?#2.2
VCC IP Boost: C?#67.2 C?#68.2 D?#8.2(K) JP?#13.1 JP?#13.3 JP?#13.5 RP?#3.1 RP?#3.2
NetC?#62_1: C?#62.1 D?#11.2(K) L?#5.1 Q?#10.3
NetC?#62_2: C?#62.2 Q?#10.1
NetC?#63_1: C?#63.1 Q?#10.8
NetC?#63_2: C?#63.2 C?#74.1 C?#75.1 C?#77.1 C?#78.1 D?#11.1(A) JP?#12.2 LED?#7.2(K) Q?#10.4 Q?#10.9(G) R?#72.2 R?#77.1 TP?#9.1
NetC?#64_1: C?#64.1 C?#65.1 C?#70.2 C?#71.2 C?#72.2 C?#73.2 C?#76.2 JP?#11.1 LED?#4.1(A) Q?#11.8 R?#70.1 R?#71.1 R?#80.2 TP?#5.1
NetC?#64_2: C?#64.2 C?#65.2 C?#76.1 JP?#11.2 Q?#11.5 Q?#12.5 Q?#12.6 Q?#12.7
NetC?#66_2: C?#66.2 Q?#8.3(D) Q?#9.1 R?#65.1
NetC?#70_1: C?#70.1 C?#71.1 C?#72.1 C?#73.1 Q?#12.1 Q?#12.2 Q?#12.3 Q?#12.4 R?#66.1 TP?#8.1
NetC?#74_2: C?#74.2 C?#75.2 JP?#12.1 L?#5.2 R?#68.1 R?#73.2
NetC?#77_2: C?#77.2 D?#9.1(A) TP?#6.1
NetC?#78_2: C?#78.2 D?#9.2(K) Q?#10.2 R?#64.2
NetC?#79_2: C?#79.2 R?#65.2
NetC?#80_2: C?#80.2 Q?#9.6 R?#67.2
NetC?#81_1: C?#81.1 Q?#10.6
NetC?#81_2: C?#81.2 R?#77.2
NetC?#82_1: C?#82.1 Q?#11.3 Q?#11.7 R?#80.1
NetC?#82_2: C?#82.2 D?#10.2(K) Q?#11.1 R?#70.2 R?#79.1
NetC?#85_1: C?#85.1 C?#86.1 C?#88.2 C?#89.2 C?#94.1 CT?.2 IC?#2.12(GND) JP?#16.4 R?#93.1 RP?#4.3 RT?.1 RT?.2 S?#3.3 S?#3.4
NetC?#88_1: C?#88.1 C?#89.1 IC?#2.16(REF) R?#85.1 R?#91.2 RP?#4.1
NetC?#92_1: C?#92.1 C?#93.1 IC?#3.3(A) JP?#19.1 R?#92.1 RP?#5.1
NetC?#92_2: C?#92.2 C?#93.2 IC?#3.1(K) JP?#19.2 R?#88.2 RP?#5.3
NetC?#94_2: C?#94.2 IC?#2.8(SOFT)
NetCT?_1: CT?.1 IC?#2.5(Ct) RD?.1
NetD?#8_1: D?#8.1(A) IC?#1.1(SW) L?#6.1
NetD?#10_1: D?#10.1(A) R?#71.2 TP?#7.1
NetIC?#1_3: IC?#1.3(FB) R?#74.2 RP?#3.3
NetIC?#1_4: IC?#1.4(EN) R?#75.2 R?#76.1
NetIC?#1_5: IC?#1.5(VCC) L?#6.2 R?#76.2 S?#2.3
NetIC?#2_1: IC?#2.1(IN-) IC?#2.9(COMP)
NetIC?#2_2: IC?#2.2(IN+) RP?#4.2
NetIC?#2_4: IC?#2.4(OSC) TP?#10.1
NetIC?#2_6: IC?#2.6(Rt) R?#89.1
NetIC?#2_7: IC?#2.7(DISC) RD?.2 RD?.3
NetIC?#2_11: IC?#2.11(A_E) JP?#16.1 S?#3.2
NetIC?#2_13: IC?#2.13(V_C) JP?#16.3 R?#85.2
NetIC?#2_14: IC?#2.14(B_E) JP?#16.2 S?#3.5
NetIC?#3_2: IC?#3.2(R) RP?#5.2
NetIC?#4_1: IC?#4.1(K) Q?#14.1(B) R?#87.2
NetIC?#4_2: IC?#4.2(R) Q?#14.2(E) RP?#6.2 RP?#6.3
NetIC?#4_3: IC?#4.3(A) R?#95.1 R?#96.1
NetJP?#18_2: JP?#18.2 Q?#14.3(C)
NetL?#7_1: L?#7.1 Q?#9.7
NetLED?#4_2: LED?#4.2(K) R?#66.2
NetLED?#5_1: LED?#5.1(A) LED?#8.2(K) Q?#9.2
NetLED?#5_2: LED?#5.2(K) LED?#6.2(K) LED?#8.1(A) LED?#9.1(A) Q?#9.4
NetLED?#6_1: LED?#6.1(A) LED?#9.2(K) Q?#9.3
NetLED?#7_1: LED?#7.1(A) R?#73.1
NetLED?#10_1: LED?#10.1(A) R?#94.2
NetLED?#11_1: LED?#11.1(A) R?#97.2
NetQ?#9_5: Q?#9.5 R?#78.2
NetQ?#10_5: Q?#10.5 R?#68.2 R?#72.1
NetQ?#10_7: Q?#10.7 R?#64.1 TP?#4.1
NetQ?#11_2: Q?#11.2 R?#79.2
NetQ?#11_4: Q?#11.4 Q?#11.6 Q?#12.8
NetR?#78_1: R?#78.1 SW?#3.2
NetR?#89_2: R?#89.2 RT?.3
NetR?#96_2: R?#96.2 RP?#6.1

Not connected (* = marked no-connect by the designer): IC?#1 6(NC)*; IC?#2 3(SYNC)*; Q?#13 5* 9*; S?#2 1; S?#3 1* 6*; USB?#3 2(D-) 3(D+)

### Notes on the sheet
- (near JP?#11) 正极
- 输入输出的压、流保护均有
- (near R?#66) 14uH 43mm多股绕线
- 14uH 43mm多股绕线
- (near JP?#12) 正极
- (near Q?#9) VIN
- (near Q?#9) L1
- (near Q?#9) VOUT
- (near Q?#9) SW
- (near Q?#11) VD
- (near Q?#11) VDD
- (near Q?#9) L2
- (near Q?#9) L3
- (near Q?#9) BAT
- (near Q?#9) KEY
- (near Q?#11) FT
- (near Q?#11) MFA
- (near Q?#11) OUT
- (near Q?#11) TD
- (near D?#11) 续流DIO
- 画PCB时注意布局
- 由编码开关控制启停
- (near LED?#5) 缺电
- (near LED?#8) →
- (near LED?#9) 满电
- (near SW?#3) 照明能力弱，砍了
- (near R?#75) EN脚大于1.5V启动，小于0.4V停止
- (near Q?#11) PTS
- (near Q?#11) GND
- 注意1117的封装看有没有
- 由SW开关控制启停
- (near Q?#11) XKT412无线输电发射部分
- 单独一块板
- 注意画PCB时参照实物图片
- 无线输电接收部分
- 贴片电容都严格选耐压高于35V的
- (near JP?#16) 只输出信号，不能带重载
- (near C?#85) 容忍8V到35V输入
- (near JP?#16) A
- 由Key按键控制启停
- 最大给锂电2.1A充电；2.4A放电（即5V口最大10W输出），0~70℃
- IP5306 单锂电充电 升压5V放电
- (near RP?#4) 改变给定信号
- (near RP?#4) 调占空比
- (near JP?#16) B
- G
- VC
- 没有电源情况下，接入电池也有5V\3.3V和升压输出
- 上拉到5.1V
- (near JP?#19) 正极
- (near JP?#18) 正极
- 调频率
- 调死区
- 模式1-占空比0-50%，双路互补可调死区
- 从A B取信号 VC不管
- 电位器决定最小电流：2.5K-1mA，1K-2.5mA
- (near C?#94) 22uf-软起时间1.26s
- (near IC?#2) EN高电平禁止输出
- 模式2-占空比0-100%，单路
- A B通过开关接GND，只需从VC取信号
- 再检查一下
- RD << RT
- SG3525 PWM信号产生
- 严格按照原理图参数，都已经反复计算好
- (near JP?#20) 正交解码
- (near JP?#21) 由跳线帽控制启停
- 2.5V到输入
- 可调基准
- 由编码开关控制同时启停
- 可调恒流源 1mA~100mA
- 2/3

### Library data of the parts
BT? = BATTERY: Multicell Battery; Published: 24-Mar-1999; LatestRevisionDate: 17-Jul-2002; LatestRevisionNote: Re-released for DXP Platform.; PackageReference: BAT-2; Publisher: Altium Limited
C?#59-C?#94 CT? = C: 无极性贴片电容; 版权归属: 源创客; 材质: X7R; BOM名称: 无极性贴片电容; 学习资源: www.ooocke.com
D?#8 = SS54: 肖特基二极管; 版权归属: 源创客; 属性: 40V/3A; BOM名称: 肖特基二极管; 学习资源: www.ooocke.com
D?#9-D?#11 = 1N4148: 高速开关二极管; 版权归属: 源创客; BOM名称: 高速开关二极管; 学习资源: www.ooocke.com
IC?#1 = SX1308: 可调升压芯片; 版权归属: 源创客; BOM名称: 可调升压芯片; 学习资源: www.ooocke.com
IC?#2 = GS3525: 开关电源管理IC; BOM名称: 电源管理IC; 版权归属: 源创客; 学习资源: www.ooocke.com
IC?#3 IC?#4 = TL431_SMD: 可调基准稳压芯片; 版权归属: 源创客; BOM名称: 可调基准稳压芯片; 学习资源: www.ooocke.com
JP?#11 JP?#12 JP?#18-JP?#21 = Header 2: 2P接插件; 版权归属: 源创客; BOM名称: 2P接插件; 学习资源: www.ooocke.com
JP?#13-JP?#15 = Header 3X2: 3*2P接插件; 版权归属: 源创客; BOM名称: 3*2P接插件; 学习资源: www.ooocke.com
JP?#16 = Header 4: 4P接插件; 版权归属: 源创客; BOM名称: 4P接插件; 学习资源: www.ooocke.com
JP?#17 = Header 3: 3P接插件; 版权归属: 源创客; BOM名称: 3P接插件; 学习资源: www.ooocke.com
L?#5-L?#7 = L-CDRH: 功率屏蔽电感; 版权归属: 源创客; BOM名称: 功率屏蔽电感; 学习资源: www.ooocke.com
LED?#4-LED?#11 = LED-SMD: 贴片LED; 版权归属: 源创客; BOM名称: 贴片LED; 学习资源: www.ooocke.com
Q?#8 = SI2301: P沟道 20V/2.8A; BOM名称: 场效应管; 版权归属: 源创客; 学习资源: www.ooocke.com; 描述: P沟道 20V/2.8A
Q?#9 Q?#10 = ESOP8
Q?#11 Q?#12 = 8
Q?#13 = 14
Q?#14 = 8050-SMD: 高频放大-NPN型; 版权归属: 源创客; 属性: 40V 1.5A 1W 100MHZ; BOM名称: 高频放大-NPN型; 学习资源: www.ooocke.com
R?#64-R?#97 = R: 贴片电阻; 版权归属: 源创客; BOM名称: 贴片电阻; 学习资源: www.ooocke.com
RD? RP?#3-RP?#6 RT? = RP-ID: 插件单联电位器; BOM名称: 插件电位器; 版权归属: 源创客; 学习资源: www.ooocke.com
S?#2 = SSW-1P: 1路波动开关; BOM名称: 波动开关; 版权归属: 源创客; 学习资源: www.ooocke.com
S?#3 = SSW-2P: 2路波动开关; BOM名称: 波动开关; 版权归属: 源创客; 学习资源: www.ooocke.com
SW?#3 = TSW 3x6: 3x6轻触开关; 版权归属: 源创客; BOM名称: 3x6轻触开关; 学习资源: www.ooocke.com
TP?#4-TP?#10 = TEST: 测试点; 版权归属: 源创客; BOM名称: 测试点; 学习资源: www.ooocke.com
USB?#3 = USB-A/S: USB-A型母接口; 版权归属: 源创客; BOM名称: USB-A型母接口; 学习资源: www.ooocke.com
V? = AMS1117: 三端稳压芯片; BOM名称: 稳压芯片; 版权归属: 源创客; 学习资源: www.ooocke.com

## Nets that join several sheets
LTC sen-: MainPower (24 pins), SubPowerr (21 pins), modules (7 pins)
VCC Is&Vref: SubPowerr (SW?#2.7), modules (JP?#18.1 R?#87.1 R?#88.1)
VCC OUT 5V: SubPowerr (9 pins), modules (JP?#21.1 Q?#8.2 R?#69.2)
VCC PW: MainPower (14 pins), SubPowerr (16 pins), modules (C?#85.2 C?#86.2 IC?#2.15)
3525 EN: SubPowerr (SW?#2.6), modules (IC?#2.10 R?#91.1)
5306 EN: SubPowerr (SW?#2.5), modules (Q?#8.1 R?#69.1)
LTC EN: MainPower (*.9 R?#10.1), SubPowerr (SW?#2.8)